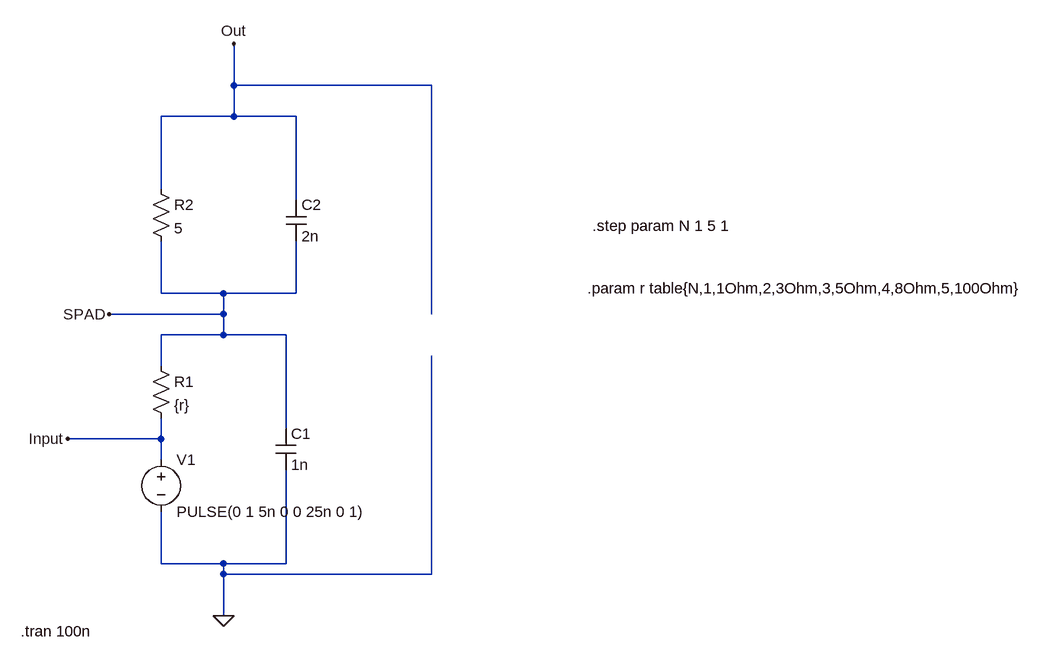
[diagram p0: schematic 1cell-cpm.asc]
1cell-cpm.asc, the LTspice schematic file:
Version 4
SHEET 1 1528 760
WIRE 256 -96 256 -160
WIRE 560 -96 256 -96
WIRE 256 -48 256 -96
WIRE 256 -48 144 -48
WIRE 352 -48 256 -48
WIRE 144 64 144 -48
WIRE 352 80 352 -48
WIRE 144 224 144 144
WIRE 240 224 144 224
WIRE 352 224 352 144
WIRE 352 224 240 224
WIRE 240 256 240 224
WIRE 240 256 64 256
WIRE 560 256 560 -96
WIRE 240 288 240 256
WIRE 240 288 144 288
WIRE 336 288 240 288
WIRE 144 336 144 288
WIRE 336 432 336 288
WIRE 144 448 144 416
WIRE 144 448 0 448
WIRE 144 480 144 448
WIRE 144 640 144 560
WIRE 240 640 144 640
WIRE 336 640 336 496
WIRE 336 640 240 640
WIRE 240 656 240 640
WIRE 560 656 560 320
WIRE 560 656 240 656
WIRE 240 720 240 656
FLAG 240 720 0
FLAG 0 448 Input
FLAG 64 256 SPAD
FLAG 256 -160 Out
SYMBOL voltage 144 464 R0
WINDOW 123 0 0 Left 0
WINDOW 39 0 0 Left 0
SYMATTR InstName V1
SYMATTR Value PULSE(0 1 5n 0 0 25n 0 1)
SYMBOL res 128 320 R0
SYMATTR InstName R1
SYMATTR Value {r}
SYMBOL cap 320 432 R0
SYMATTR InstName C1
SYMATTR Value 1n
SYMBOL cap 336 80 R0
SYMATTR InstName C2
SYMATTR Value 2n
SYMBOL res 128 48 R0
SYMATTR InstName R2
SYMATTR Value 5
TEXT -72 744 Left 2 !.tran 100n
TEXT 808 120 Left 2 !.step param N 1 5 1
TEXT 800 216 Left 2 !.param r table{N,1,1Ohm,2,3Ohm,3,5Ohm,4,8Ohm,5,100Ohm}

The netlist it stands for:
* 1cell-cpm.asc
V1 Input 0 PULSE(0 1 5n 0 0 25n 0 1)
R1 SPAD Input {r}
C1 SPAD 0 1n
C2 Out SPAD 2n
R2 Out SPAD 5
.tran 100n
.step param N 1 5 1
.param r table{N,1,1Ohm,2,3Ohm,3,5Ohm,4,8Ohm,5,100Ohm}
.backanno
.end